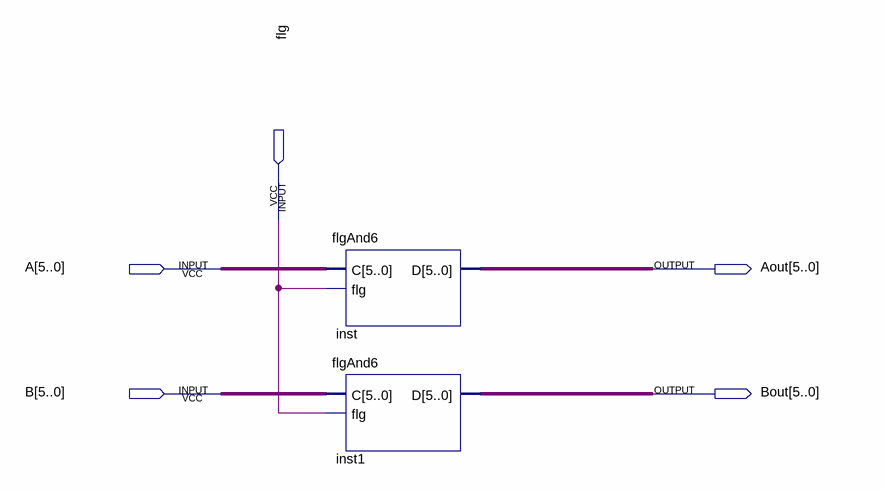
[diagram p0: schematic sheet]
// Quartus schematic flgAnd6x2.bdf as structural Verilog: 2 symbols, 5 pins
module flgAnd6x2 (
  input  flg,
  input  [5:0] A,
  input  [5:0] B,
  output [5:0] Aout,
  output [5:0] Bout
);

  flgAnd6 inst (.C(A), .flg(flg), .D(Aout));
  flgAnd6 inst1 (.C(B), .flg(flg), .D(Bout));
endmodule
